# EasyEDA Pro project STM32最小系统.eprj

# Schematic Schematic1
Create Date: 2023-10-13; Page Name: 原理图; Project Name: STM32最小系统; Schematic Name: Schematic1; Update Date: 2023-10-28; Company: 王庆浩; Page Size: A4; Version: V1.0
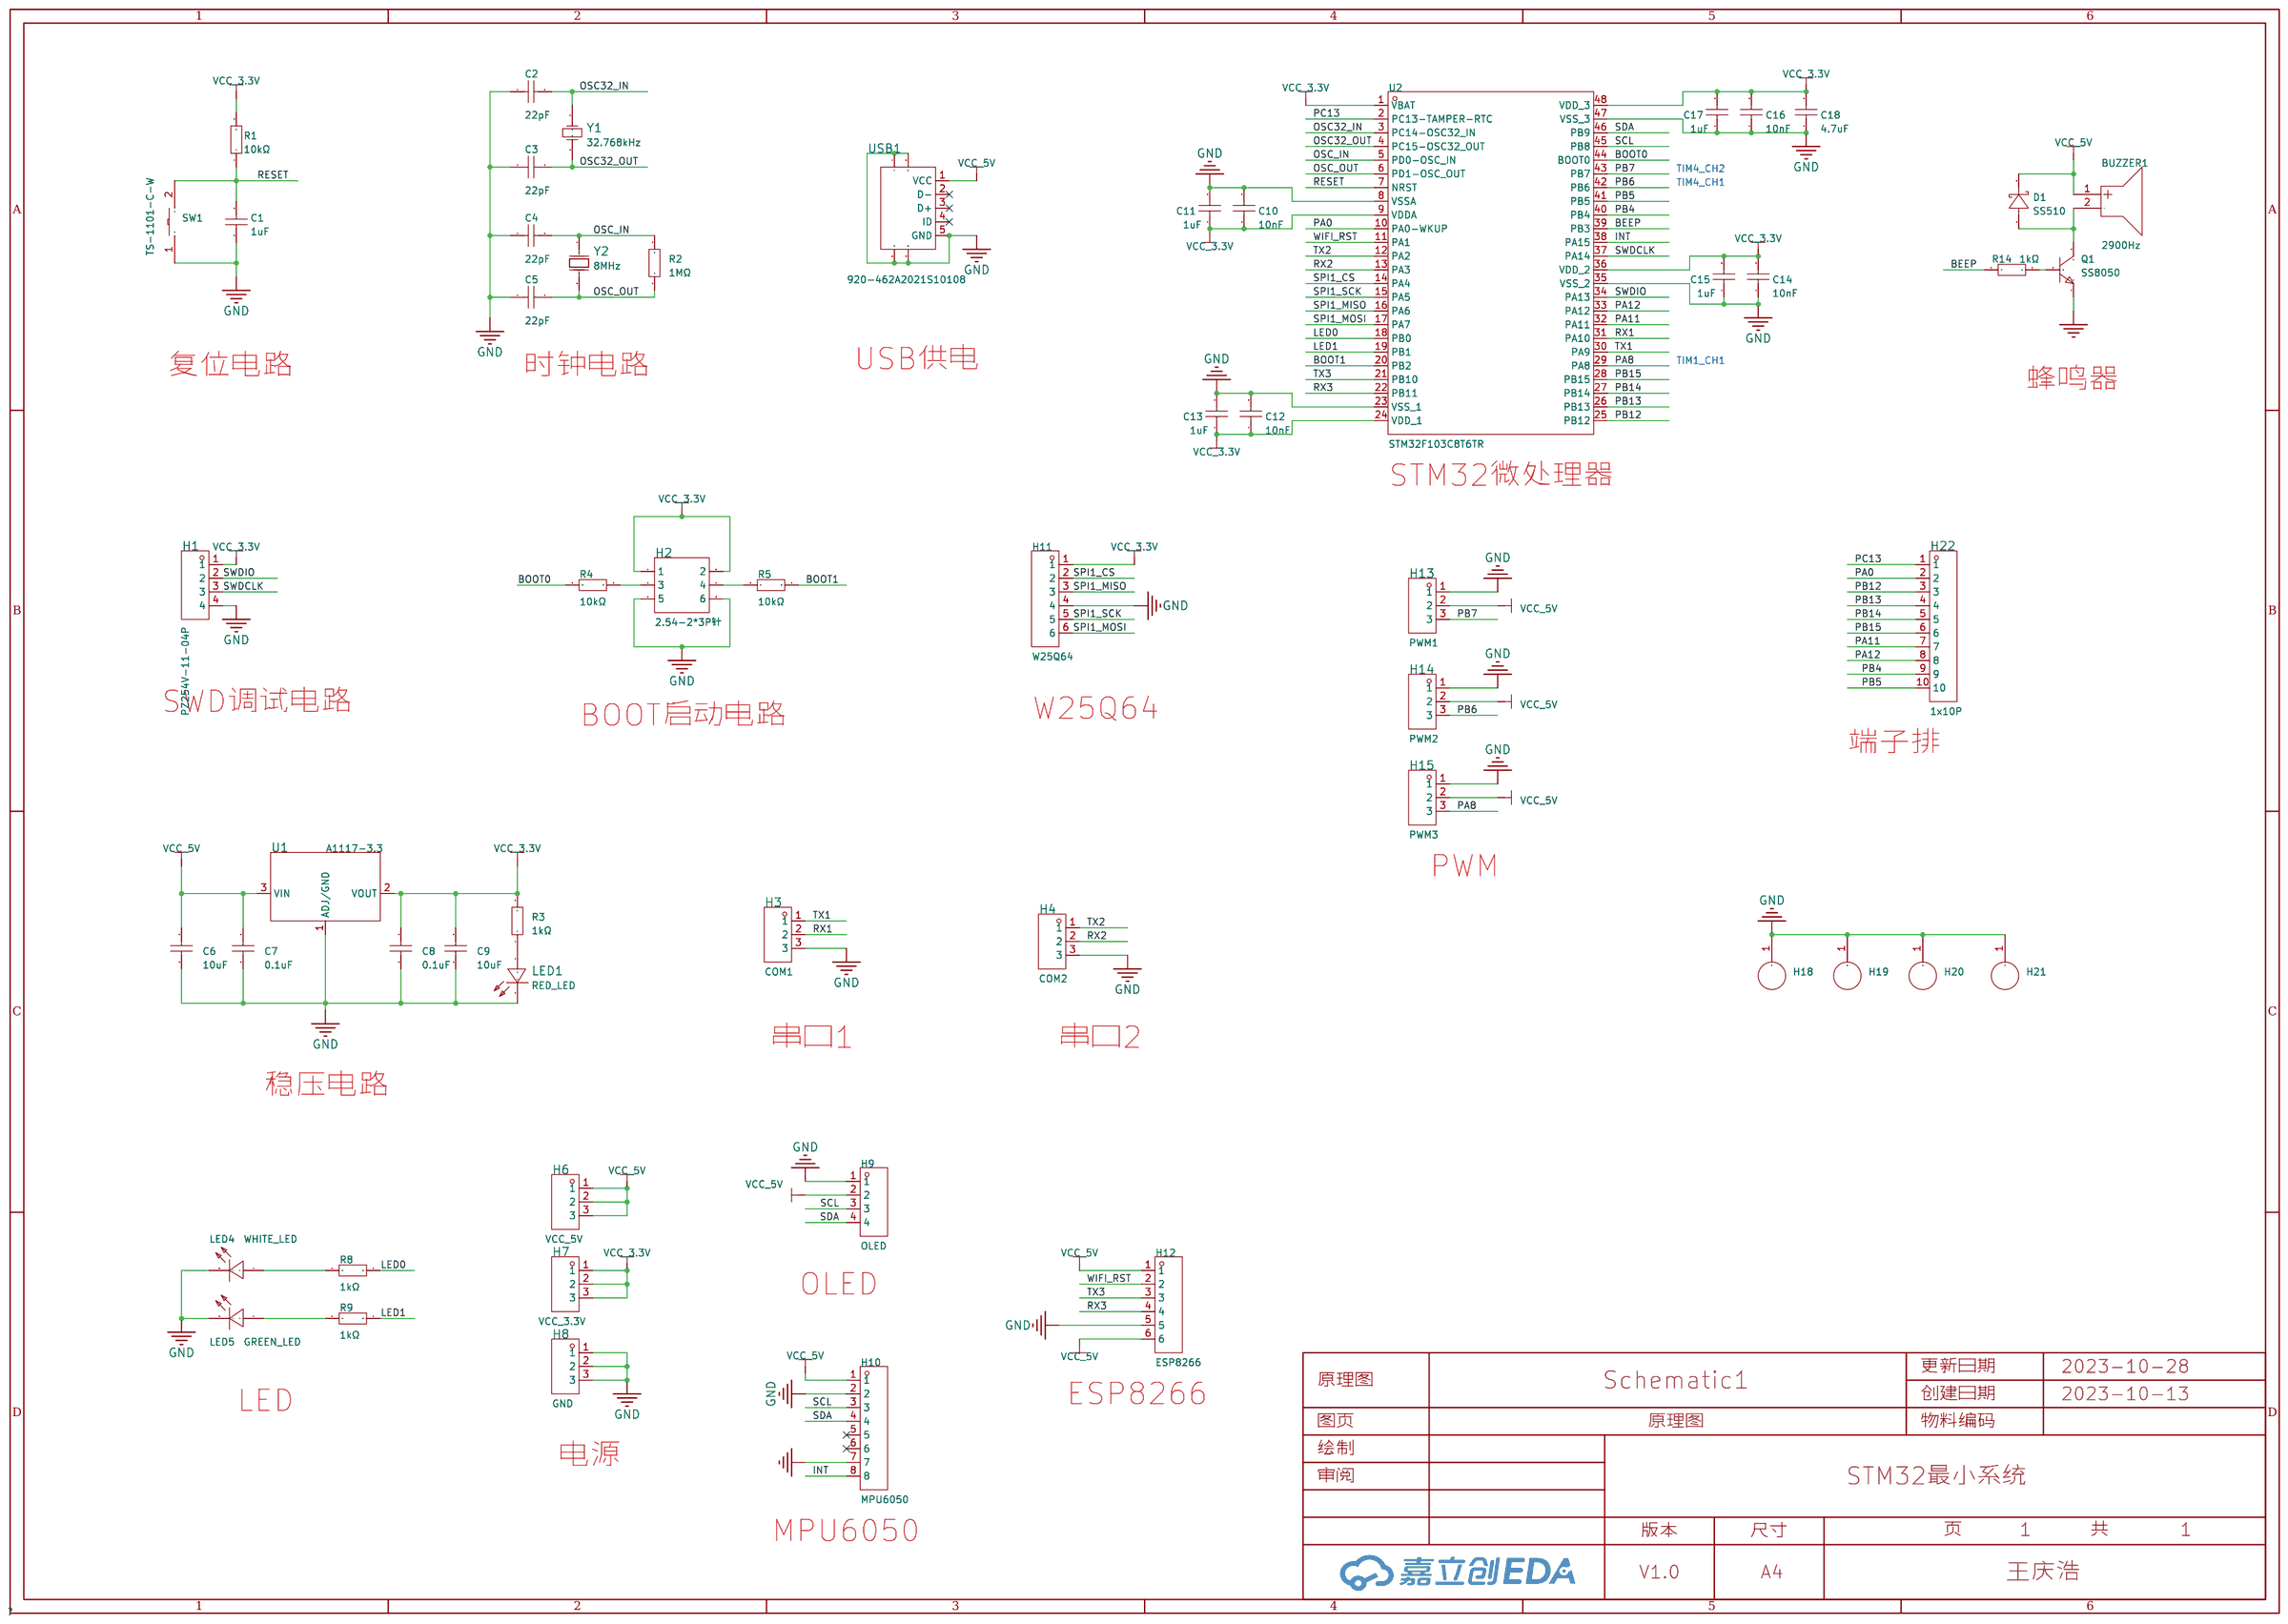
[diagram p0: schematic sheet]

## Parts
BUZZER1  2900Hz  [BUZ-TH_BD9.6-P5.00-D0.7-FD]
C1  1uF  [C0805]
C2  22pF  [C0805]
C3  22pF  [C0805]
C4  22pF  [C0805]
C5  22pF  [C0805]
C6  10uF  [C0805]
C7  0.1uF  [C0805]
C8  0.1uF  [C0805]
C9  10uF  [C0805]
C10  10nF  [C0805]
C11  1uF  [C0805]
C12  10nF  [C0805]
C13  1uF  [C0805]
C14  10nF  [C0805]
C15  1uF  [C0805]
C16  10nF  [C0805]
C17  1uF  [C0805]
C18  4.7uF  [C0805]
D1  SS510  [SMA_L4.3-W2.6-LS5.0-RD]
H1  PZ254V-11-04P  [HDR-TH_4P-P2.54-V-M]
H2  2.54-2*3P针  [HDR-TH_6P-P2.54-V-M-R2-C3-S2.54-1]
H3  COM1  [HDR-TH_3P-P2.54-V-M]
H4  COM2  [HDR-TH_3P-P2.54-V-M]
H6  VCC_5V  [HDR-TH_3P-P2.54-V-M]
H7  VCC_3.3V  [HDR-TH_3P-P2.54-V-M]
H8  GND  [HDR-TH_3P-P2.54-V-M]
H9  OLED  [HDR-TH_4P-P2.54-V-F]
H10  MPU6050  [HDR-TH_8P-P2.54-V-F]
H11  W25Q64  [HDR-TH_6P-P2.54-V-F]
H12  ESP8266  [HDR-TH_6P-P2.54-V-F]
H13  PWM1  [HDR-TH_3P-P2.54-V-M]
H14  PWM2  [HDR-TH_3P-P2.54-V-M]
H15  PWM3  [HDR-TH_3P-P2.54-V-M]
H18  -  [固定孔封装]
H19  -  [固定孔封装]
H20  -  [固定孔封装]
H21  -  [固定孔封装]
H22  1x10P  [HDR-TH_10P-P2.54-V-M]
LED1  RED_LED  [LED1206-R-RD_RED]
LED4  WHITE_LED  [LED0805-R-RD]
LED5  GREEN_LED  [LED0805-R-RD]
Q1  SS8050  [SOT-23-3_L2.9-W1.3-P1.90-LS2.4-BR]
R1  10kΩ  [R0805]
R2  1MΩ  [R0805]
R3  1kΩ  [R0805]
R4  10kΩ  [R0805]
R5  10kΩ  [R0805]
R8  1kΩ  [R0805]
R9  1kΩ  [R0805]
R14  1kΩ  [R0805]
SW1  TS-1101-C-W  [SW-SMD_L6.0-W3.3-LS8.0]
U1  A1117-3.3  [SOT-223-3_L6.5-W3.4-P2.30-LS7.0-BR-1]
U2  STM32F103C8T6TR  [LQFP-48_L7.0-W7.0-P0.50-LS9.0-BL]
USB1  920-462A2021S10108  [MINI-USB-SMD_C105424]
Y1  32.768kHz  [OSC-TH_BD3.1-P0.8-D0.3]
Y2  8MHz  [OSC-TH_L10.0-W4.5-P5.00]

## Library data of the parts
BUZZER1 = Cy-9650-5029: 驱动方式:有源(内含驱动线路);构造类型:电磁式;额定电压:5V;工作电压:4V~7V;频率:2900Hz;声压(SPL):85dB@5V,10cm;直径(φD):9.6mm;高度:5.5mm;; LCSC Part Name: 电磁式有源蜂鸣器; Supplier Part: C200213; Manufacturer: CY(超音); Supplier Footprint: 插件; JLCPCB Part Class: 扩展库; Datasheet: https://atta.szlcsc.com/upload/public/pdf/source/20180420/C200213_A5C4D66C08EDDCFBFC3C90ECB296389D.pdf; Supplier: LCSC; Oscillator Circuit: 有源(内含驱动线路); Technology Type: 电磁式; Rated Voltage: 5V; Operating Voltage: 4V~7V; Sound Pressure Level (SPL): 85dB@5V,10cm; Diameter (φD): 9.6mm; Height: 5.5mm
C1 C11 C13 C15 C17 = CL21B105KBFNNNE: 容值:1uF;精度:±10%;额定电压:50V;材质(温度系数):X7R;; LCSC Part Name: 1uF ±10% 50V; Supplier Part: C28323; Manufacturer: SAMSUNG(三星); Supplier Footprint: 0805; JLCPCB Part Class: 基础库; Datasheet: https://atta.szlcsc.com/upload/public/pdf/source/20160103/1457707718219.pdf; Supplier: LCSC; Tolerance: ±10%; Voltage Rated: 50V; Temperature Coefficient: X7R
C2-C5 = CL21C220JBANNNC: 容值:22pF;精度:±5%;额定电压:50V;材质(温度系数):C0G;; LCSC Part Name: 22pF ±5% 50V; Supplier Part: C1804; Manufacturer: SAMSUNG(三星); Supplier Footprint: 0805; JLCPCB Part Class: Basic Part; Datasheet: https://atta.szlcsc.com/upload/public/pdf/source/20160103/1457707697973.pdf; Supplier: LCSC; Tolerance: ±5%; Voltage Rated: 50V; Temperature Coefficient: C0G
C6-C9 = CC0805KRX7R9BB104: 容值:100nF;精度:±10%;额定电压:50V;材质(温度系数):X7R;; LCSC Part Name: 100nF ±10% 50V; Supplier Part: C49678; Manufacturer: YAGEO(国巨); Supplier Footprint: 0805; JLCPCB Part Class: Basic Part; Datasheet: https://atta.szlcsc.com/upload/public/pdf/source/20151026/1457707504898.pdf; Supplier: LCSC; Tolerance: ±10%; Voltage Rated: 50V; Temperature Coefficient: X7R
C10 C12 C14 C16 C18 = 0805B103K500NT_C52278: 容值:10nF;精度:±10%;额定电压:50V;材质(温度系数):X7R;; LCSC Part Name: 10nF ±10% 50V; Supplier Part: C52278; Manufacturer: FH(风华); Manufacturer Part: 0805B103K500NT; Supplier Footprint: 0805; JLCPCB Part Class: Extended Part; Datasheet: https://atta.szlcsc.com/upload/public/pdf/source/20170923/C52278_1506149485247988826.pdf; Supplier: LCSC; Tolerance: ±10%; Voltage Rated: 50V; Temperature Coefficient: X7R
D1 = SS510_C727067: 二极管配置:独立式;直流反向耐压(Vr):100V;平均整流电流(Io):5A;正向压降(Vf):850mV@5A;反向电流(Ir):500uA@100V;; LCSC Part Name: 100V 5A 850mV@5A; Supplier Part: C727067; Manufacturer: TWGMC(台湾迪嘉); Supplier Footprint: SMA; JLCPCB Part Class: Extended Part; Datasheet: https://atta.szlcsc.com/upload/public/pdf/source/20200828/C727064_BD0A2B36CBC76CEA4B6710C57718D41F.pdf; Supplier: LCSC; Diode Configuration: 独立式; Reverse Voltage (Vr): 100V; Average Rectified Current (Io): 5A; Forward Voltage (Vf@If): 850mV@5A; Reverse Leakage Current (Ir): 500uA@100V
H1 = PZ254V-11-04P: 排数:单排;总PIN位数:4P;间距:2.54mm;插针结构:1x4P;行距:-;安装类型:直插;圆针/方针:方针;额定电流:3A;额定电压:250V;配合针长度:6mm;塑高:2.5mm;端接针长度:3mm;触头材质:-;工作温度范围:-40℃~+105℃;颜色:黑色;; LCSC Part Name: 2.54mm 1x4P 直插 方针; Supplier Part: C2691448; Manufacturer: XFCN(兴飞); Supplier Footprint: 插件,P=2.54mm; JLCPCB Part Class: Extended Part; Datasheet: https://atta.szlcsc.com/upload/public/pdf/source/20200309/C492403_F9F19131791D08044AD4F84F8E751A34.pdf; Supplier: LCSC; Number of Rows: 单排; Number of Pins: 4P; Pitch: 2.54mm; Pin Structure: 1x4P; Mounting Type: 直插; Circluar Pins/Square Pins: 方针; Current Rating (Max): 3A; Voltage Rating (Max): 250V; Length of Mating Pin: 6mm; Insulation Height: 2.5mm; Length of End Connection Pin: 3mm; Operating Temperature Range: -40℃~+105℃; Color: 黑色
H2 = 2.54-2*3P针: 排数:双排;总PIN位数:6P;间距:2.54mm;插针结构:-;行距:-;安装类型:直插;圆针/方针:-;额定电流:-;额定电压:-;配合针长度:-;塑高:-;触头材质:-;触头镀层:-;颜色:黑色;; LCSC Part Name: 2.54mm 直插; Supplier Part: C65114; Manufacturer: BOOMELE(博穆精密); Supplier Footprint: 插件,P=2.54mm; JLCPCB Part Class: Extended Part; Supplier: LCSC; Number of Rows: 双排; Number of Pins: 6P; Pitch: 2.54mm; Mounting Type: 直插; Color: 黑色
H3 H4 H6-H8 H13-H15 = PZ254V-11-03P: 排数:单排;总PIN位数:3;间距:2.54mm;插针结构:1x3P;行距:-;安装类型:直插;圆针/方针:方针;额定电流:3A;额定电压:250V;配合针长度:6mm;塑高:2.5mm;端接针长度:3mm;工作温度范围:-40℃~+105℃;颜色:黑色;; LCSC Part Name: 2.54mm 1x3P 直插 方针; Supplier Part: C2937625; Manufacturer: XFCN(兴飞); Supplier Footprint: 直插,P=2.54mm; JLCPCB Part Class: Extended Part; Datasheet: 2022-07-12/581362A/62b9d00620994b3696be7eb4af85ad72/双排排针和单排排针.pdf; Supplier: LCSC; Number of Rows: 单排; Number of Pins: 3; Pitch: 2.54mm; Pin Structure: 1x3P; Mounting Type: 直插; Circluar Pins/Square Pins: 方针; Current Rating (Max): 3A; Voltage Rating (Max): 250V; Length of Mating Pin: 6mm; Insulation Height: 2.5mm; Length of End Connection Pin: 3mm; Operating Temperature Range: -40℃~+105℃; Color: 黑色
H9 = PM254V-11-04-H85: 排数:单排;总孔位数:4P;间距:2.54mm;插孔结构:1x4P;行距:-;安装类型:直插;塑高:-;触头材质:黄铜;触头镀层:-;; LCSC Part Name: 间距:2.54mm 1x4P 直插; Supplier Part: C541851; Manufacturer: XFCN(兴飞); Supplier Footprint: 插件,P=2.54mm; JLCPCB Part Class: Extended Part; Datasheet: https://atta.szlcsc.com/upload/public/pdf/source/20200518/C541849_85853D71FC67C51915A806977A588FDA.pdf; Supplier: LCSC; Number of Rows: 单排; Number of Holes: 4P; Pitch: 2.54mm; Holes Structure: 1x4P; Mounting Type: 直插; Contact Material: 黄铜
H10 = PM254-1-08-Z-8.5: 排数:单排;总孔位数:8P;间距:2.54mm;插孔结构:1x8P;行距:-;安装类型:直插;圆孔/方孔:方孔;额定电流:3A;额定电压:-;插孔方向:顶部;塑高:8.5mm;工作温度范围:-40℃~+105℃;; LCSC Part Name: 间距:2.54mm 1x8P 直插; Supplier Part: C2897371; Manufacturer: HCTL(华灿天禄); Supplier Footprint: 插件,P=2.54mm; JLCPCB Part Class: Extended Part; Datasheet: https://atta.szlcsc.com/upload/public/pdf/source/20230609/534BE42964C679BDE98E061007C4ABD6.pdf; Supplier: LCSC; Number of Rows: 单排; Number of Holes: 8P; Pitch: 2.54mm; Holes Structure: 1x8P; Mounting Type: 直插; Circular Hole / Square Hole: 方孔; Current Rating (Max): 3A; Holes Direction: 顶部; Insulation Height: 8.5mm; Operating Temperature Range: -40℃~+105℃
H11 H12 = PM254V-11-06-H85: 排数:单排;总孔位数:6P;间距:2.54mm;插孔结构:1x6P;行距:-;安装类型:直插;圆孔/方孔:方孔;额定电流:3A;额定电压:250V;插孔方向:顶部;塑高:-;工作温度范围:-40℃~+105℃;; LCSC Part Name: 间距:2.54mm 1x6P 直插; Supplier Part: C2832269; Manufacturer: XFCN(兴飞); Supplier Footprint: 插件,P=2.54mm; JLCPCB Part Class: Extended Part; Datasheet: https://atta.szlcsc.com/upload/public/pdf/source/20210514/C2832269_B3EC97736B37C2783BDCE3050AA57447.pdf; Supplier: LCSC; Number of Rows: 单排; Number of Holes: 6P; Pitch: 2.54mm; Holes Structure: 1x6P; Mounting Type: 直插; Circular Hole / Square Hole: 方孔; Current Rating (Max): 3A; Voltage Rating (Max): 250V; Holes Direction: 顶部; Operating Temperature Range: -40℃~+105℃
H18-H21 = 固定孔: 铜柱孔
H22 = PZ254V-11-10P: 排数:单排;总PIN位数:10P;间距:2.54mm;插针结构:1x10P;行距:-;安装类型:直插;圆针/方针:方针;额定电流:-;额定电压:-;配合针长度:6mm;塑高:2.5mm;端接针长度:3mm;触头材质:黄铜;触头镀层:-;工作温度范围:-40℃~+105℃;颜色:黑色;; LCSC Part Name: 2.54mm 1x10P 直插 方针; Supplier Part: C492409; Manufacturer: XFCN(兴飞); Supplier Footprint: 插件,P=2.54mm; JLCPCB Part Class: 扩展库; Datasheet: https://atta.szlcsc.com/upload/public/pdf/source/20200309/C492409_129C9431BDD62EBBBD0A643B6AAB9FBD.pdf; Supplier: LCSC; Number of Rows: 单排; Number of Pins: 10P; Pitch: 2.54mm; Mounting Type: 直插; Circluar Pins/Square Pins: 方针; Length of Mating Pin: 6mm; Insulation Height: 2.5mm; Length of End Connection Pin: 3mm; Contact Material: 黄铜; Operating Temperature Range: -40℃~+105℃; Color: 黑色
LED1 = NCD1206R1: 发光颜色:红灯;; LCSC Part Name: 红灯 1206红灯   正贴; Supplier Part: C84270; Manufacturer: 国星光电; Supplier Footprint: 1206; JLCPCB Part Class: 扩展库; Datasheet: https://atta.szlcsc.com/upload/public/pdf/source/20200820/C84270_26D056BA53480CD9796A84C2EB45318C.pdf; Supplier: LCSC; Emitted Color: 红灯
LED4 LED5 = NCD0805R1: 发光颜色:红灯;; LCSC Part Name: 红灯; Supplier Part: C84256; Manufacturer: 国星光电; Supplier Footprint: 0805; JLCPCB Part Class: Basic Part; Datasheet: https://atta.szlcsc.com/upload/public/pdf/source/20200820/C84256_F0A75A43B3EAD75808600A0514C76B99.pdf; Supplier: LCSC; Emitted Color: 红灯
Q1 = SS8050_C2150: 晶体管类型:NPN;集射极击穿电压(Vceo):25V;集电极电流(Ic):1.5A;功率(Pd):300mW;直流电流增益(hFE@Ic,Vce):200@100mA,1V;; LCSC Part Name: NPN 25V 1.5A Y1 200-350; Supplier Part: C2150; Manufacturer: CJ(江苏长电/长晶); Supplier Footprint: SOT-23; JLCPCB Part Class: 基础库; Datasheet: https://atta.szlcsc.com/upload/public/pdf/source/20230322/AEE86F4B043774EFF80CAEA14A37D9E9.pdf; Supplier: LCSC; Transistor Type: NPN; Collector-Emitter Breakdown Voltage (Vceo): 25V; Collector Current (Ic): 1.5A; Power Dissipation (Pd): 300mW; Collector Cut-Off Current (Icbo): 100nA; Collector-Emitter Saturation Voltage (VCE(sat)@Ic,Ib): 500mV@800mA,80mA; DC Current Gain (hFE@Ic,Vce): 200@100mA,1V; Transition Frequency (fT): 100MHz; Operating Temperature: +150℃@(Tj)
R1 R4 R5 = 0805W8F1002T5E_C17414: 电阻类型:厚膜电阻;阻值:10kΩ;精度:±1%;功率:125mW;; LCSC Part Name: 10kΩ ±1% 125mW; Supplier Part: C17414; Manufacturer: UNI-ROYAL(厚声); Manufacturer Part: 0805W8F1002T5E; Supplier Footprint: 0805; JLCPCB Part Class: 基础库; Datasheet: https://atta.szlcsc.com/upload/public/pdf/source/20200306/C422600_1E6D84923E4A46A82E41ADD87F860B5C.pdf; Supplier: LCSC; Type: 厚膜电阻; Tolerance: ±1%; Power(Watts): 125mW; Temperature Coefficient: ±100ppm/℃; Overload Voltage (Max): 150V; Operating Temperature Range: -55℃~+155℃
R2 = 0805W8F1004T5E: 电阻类型:厚膜电阻;阻值:1MΩ;精度:±1%;功率:125mW;; LCSC Part Name: 1MΩ ±1% 125mW; Supplier Part: C17514; Manufacturer: UNI-ROYAL(厚声); Supplier Footprint: 0805; JLCPCB Part Class: Basic Part; Datasheet: https://atta.szlcsc.com/upload/public/pdf/source/20200306/C422600_1E6D84923E4A46A82E41ADD87F860B5C.pdf; Supplier: LCSC; Type: 厚膜电阻; Tolerance: ±1%; Power(Watts): 125mW; Temperature Coefficient: ±100ppm/℃; Overload Voltage (Max): 150V; Operating Temperature Range: -55℃~+155℃
R3 R8 R9 R14 = 0805W8F1001T5E: 电阻类型:厚膜电阻;阻值:1kΩ;精度:±1%;功率:125mW;; LCSC Part Name: 1kΩ ±1% 125mW; Supplier Part: C17513; Manufacturer: UNI-ROYAL(厚声); Supplier Footprint: 0805; JLCPCB Part Class: Basic Part; Datasheet: https://atta.szlcsc.com/upload/public/pdf/source/20200306/C422600_1E6D84923E4A46A82E41ADD87F860B5C.pdf; Supplier: LCSC; Type: 厚膜电阻; Tolerance: ±1%; Power(Watts): 125mW; Temperature Coefficient: ±100ppm/℃; Overload Voltage (Max): 150V; Operating Temperature Range: -55℃~+155℃
SW1 = TS-1101-C-W: 触点电流:50mA;额定电压(AC):-;额定电压(DC):12V;额定功率:-;绝缘电阻:-;电路结构:单刀单掷;安装方式:立贴;带灯:无;作用力:260gf;机械寿命:5万次;带支架:否;; LCSC Part Name: 立贴 6*3.6*2.5mm 轻触开关 一型3*6*2.5有白ZD b拉伸白色带淡绿按键 卷装; Supplier Part: C318938; Manufacturer: XKB Connectivity(中国星坤); Supplier Footprint: SMD; JLCPCB Part Class: 扩展库; Datasheet: https://atta.szlcsc.com/upload/public/pdf/source/20200227/C318938_C2E53B1EEDE37D980A33616AC086DE53.pdf; Supplier: LCSC; Contact Current: 50mA; Voltage Rating (DC): 12V; Circuit: 单刀单掷; Mounting Style: 立贴; Actuator Style: 矩形按钮; Actuator/Cap Color: 白色带淡绿; With Lamp: 无; Operating Force: 260gf; Mechanical Life: 5万次; Operating Temperature: -30℃~+85℃; Switch Length: 6mm; Switch Width: 3.6mm; Switch Height: 2.5mm; Strike Gundam: 否
U1 = A1117-3.3: LCSC Part Name: AMS1117-3.3; Supplier Part: C7432020; Manufacturer: IDCHIP(英锐芯); Supplier Footprint: SOT-223; Datasheet: https://atta.szlcsc.com/upload/public/pdf/source/20230625/435FEEFA02C0FE449E7397A11F8448E0.pdf; Supplier: LCSC
U2 = STM32F103C8T6TR: Supplier Part: C2969777; Manufacturer: ST(意法半导体); Supplier Footprint: LQFP-48; JLCPCB Part Class: 扩展库; Datasheet: https://atta.szlcsc.com/upload/public/pdf/source/20220628/95EE8CB51361BFD20205E6D0986143A8.pdf; Supplier: LCSC
USB1 = 920-462A2021S10108: 连接器类型:Mini-B;标准:USB 2.0;公母:母座;触点数量:5P;端口数量:1;; LCSC Part Name: Mini-B 母座; Supplier Part: C105424; Manufacturer: 精拓金; Supplier Footprint: SMD; JLCPCB Part Class: Extended Part; Datasheet: https://atta.szlcsc.com/upload/public/pdf/source/20210305/C105424_2FE4567BA4C4825921316FFF365C367B.pdf; Supplier: LCSC; Connector Type: Mini-B; Standard: USB 2.0; Gender: 母座; Number of Contacts: 5P; Number of Ports: 1
Y1 = X308032768KGB2SC: 频率:32.768kHz;频率公差:±10ppm;负载电容:12.5pF;; LCSC Part Name: 32.768kHz ±10ppm 12.5pF YT-38; Supplier Part: C52082; Manufacturer: YXC(扬兴晶振); Supplier Footprint: DT-38; JLCPCB Part Class: 扩展库; Datasheet: https://atta.szlcsc.com/upload/public/pdf/source/20210729/394323D37097DADF5DA3ECA9C1DCF4BF.pdf; Supplier: LCSC; Crystal Type: 圆柱体晶振; Frequency Tolerance: ±10ppm; Load Capacitance: 12.5pF; Operating Temperature: -20℃~+70℃
Y2 = X49SD8MSD2SC: 频率:8MHz;频率公差:±20ppm;负载电容:20pF;; LCSC Part Name: 8MHz ±20ppm 20pF HC-49US; Supplier Part: C21263; Manufacturer: YXC(扬兴晶振); Supplier Footprint: HC-49S; JLCPCB Part Class: Extended Part; Datasheet: https://atta.szlcsc.com/upload/public/pdf/source/20210903/A997D130AE99CBB55D9024F9BE6DA174.pdf; Supplier: LCSC; Crystal Type: 49S晶振; Frequency Tolerance: ±20ppm; Frequency Stability: ±30ppm; Load Capacitance: 20pF; Operating Temperature: -20℃~+70℃

## Nets
GND: C1.1 C2.1 C3.1 C4.1 C5.1 C6.1 C7.1 C8.1 C9.1 C10.2 C11.2 C12.2 C13.2 C14.1 C15.1 C16.1 C17.1 C18.1 H1.4 H2.5 H2.6 H3.3 H4.3 H8.1 H8.2 H8.3 H9.1 H10.2 H10.7 H11.4 H12.5 H13.1 H14.1 H15.1 H18.1 H19.1 H20.1 H21.1 LED1.2(K) LED4.2(-) LED5.2(-) Q1.2(E) SW1.1 U1.1(ADJ/GND) U2.8(VSSA) U2.23(VSS_1) U2.35(VSS_2) U2.47(VSS_3) USB1.5(GND) USB1.6 USB1.7 USB1.8 USB1.9
VCC_3.3V: C8.2 C9.2 C10.1 C11.1 C12.1 C13.1 C14.2 C15.2 C16.2 C17.2 C18.2 H1.1 H2.1 H2.2 H7.1 H7.2 H7.3 H11.1 R1.2 R3.2 U1.2(VOUT) U2.1(VBAT) U2.9(VDDA) U2.24(VDD_1) U2.36(VDD_2) U2.48(VDD_3)
VCC_5V: BUZZER1.1(+) C6.2 C7.2 D1.1(K) H6.1 H6.2 H6.3 H9.2 H10.1 H12.1 H12.6 H13.2 H14.2 H15.2 U1.3(VIN) USB1.1(VCC)
BEEP: R14.2 U2.39(PB3)
BOOT0: R4.1 U2.44(BOOT0)
BOOT1: R5.2 U2.20(PB2)
INT: H10.8 U2.38(PA15)
LED0: R8.1 U2.18(PB0)
LED1: R9.1 U2.19(PB1)
OSC32_IN: C2.2 U2.3(PC14-OSC32_IN) Y1.2(OSC2)
OSC32_OUT: C3.2 U2.4(PC15-OSC32_OUT) Y1.1(OSC1)
OSC_IN: C4.2 R2.2 U2.5(PD0-OSC_IN) Y2.1(OSC1)
OSC_OUT: C5.2 R2.1 U2.6(PD1-OSC_OUT) Y2.2(OSC2)
PA0: H22.2 U2.10(PA0-WKUP)
PA8: H15.3 U2.29(PA8)
PA11: H22.7 U2.32(PA11)
PA12: H22.8 U2.33(PA12)
PB4: H22.9 U2.40(PB4)
PB5: H22.10 U2.41(PB5)
PB6: H14.3 U2.42(PB6)
PB7: H13.3 U2.43(PB7)
PB12: H22.3 U2.25(PB12)
PB13: H22.4 U2.26(PB13)
PB14: H22.5 U2.27(PB14)
PB15: H22.6 U2.28(PB15)
PC13: H22.1 U2.2(PC13-TAMPER-RTC)
RESET: C1.2 R1.1 SW1.2 U2.7(NRST)
RX1: H3.2 U2.31(PA10)
RX2: H4.2 U2.13(PA3)
RX3: H12.4 U2.22(PB11)
SCL: H9.3 H10.3 U2.45(PB8)
SDA: H9.4 H10.4 U2.46(PB9)
SPI1_CS: H11.2 U2.14(PA4)
SPI1_MISO: H11.3 U2.16(PA6)
SPI1_MOSI: H11.6 U2.17(PA7)
SPI1_SCK: H11.5 U2.15(PA5)
SWDCLK: H1.3 U2.37(PA14)
SWDIO: H1.2 U2.34(PA13)
TX1: H3.1 U2.30(PA9)
TX2: H4.1 U2.12(PA2)
TX3: H12.3 U2.21(PB10)
WIFI_RST: H12.2 U2.11(PA1)
$1N2099: H2.3 R4.2
$1N2100: H2.4 R5.1
$1N5135: LED1.1(A) R3.1
$1N5723: LED4.1(+) R8.2
$1N5726: LED5.1(+) R9.2
$1N9189: Q1.1(B) R14.1
$1N9400: BUZZER1.2(-) D1.2(A) Q1.3(C)

Not connected (* = marked no-connect by the designer): H10 5* 6*; USB1 2(D-)* 3(D+)* 4(ID)*

## Notes on the sheet
- TIM4_CH2
- TIM4_CH1
- USB供电
- TIM1_CH1
- 复位电路
- 时钟电路
- 蜂鸣器
- STM32微处理器
- SWD调试电路
- BOOT启动电路
- W25Q64
- 端子排
- PWM
- 串口1
- 串口2
- 稳压电路
- OLED
- ESP8266
- LED
- 电源
- MPU6050

# Board PCB1
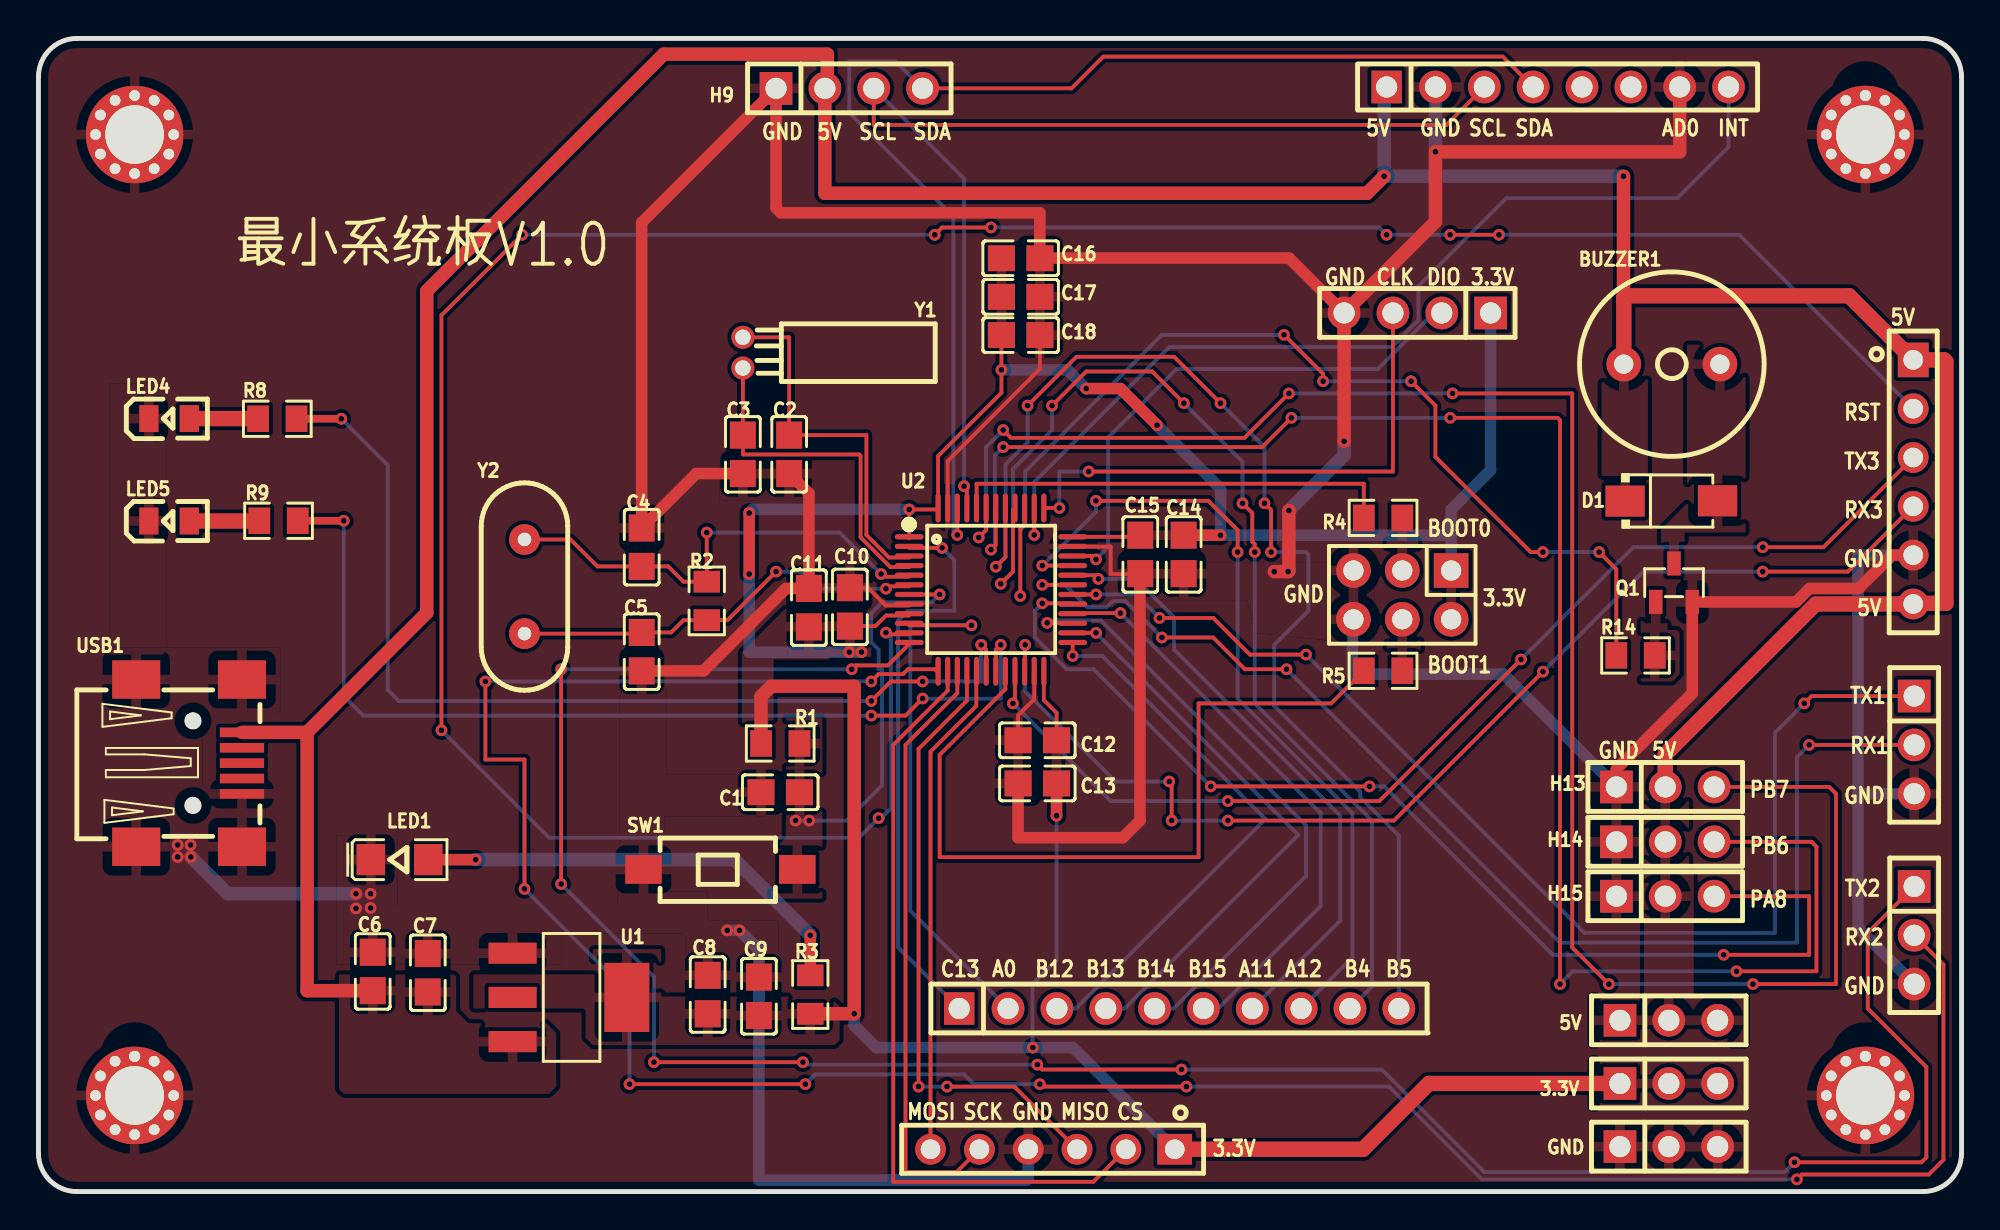
[diagram p1: board, top side]
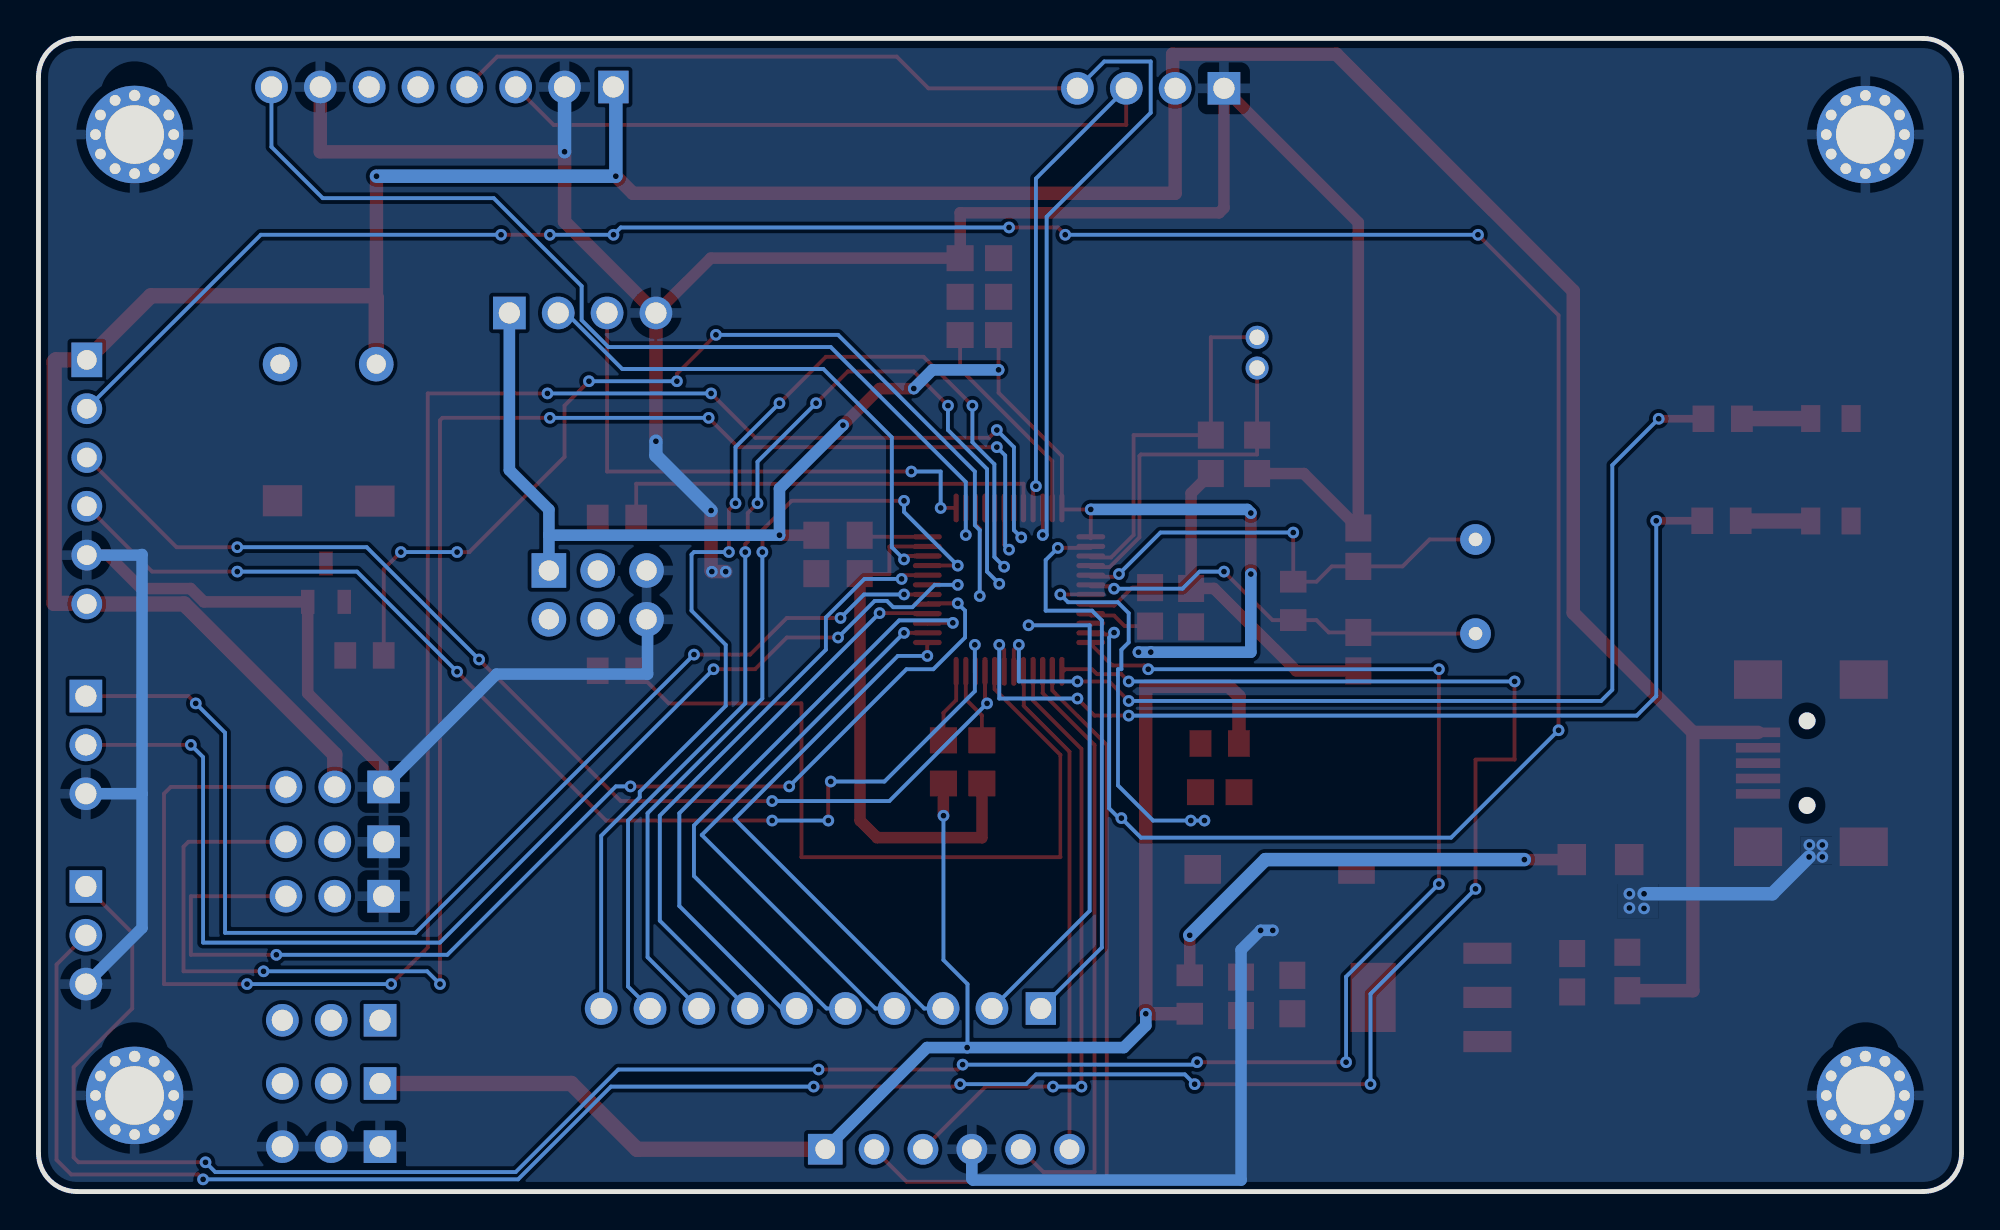
[diagram p2: board, bottom side, seen from below]

Outline 100 x 60 mm; copper layers: Top Layer, Bottom Layer. Coordinates in mm from the lower left corner of the outline.
Outline path: 0,58 0,2 arc(0.59,0.59) 2,0 98,0 arc(99.41,0.59) 100,2 100,58 arc(99.41,59.41) 98,60 2,60 arc(0.59,59.41) 0,58
Stack: Top Layer 0.035mm / Dielectric1 1.51mm FR4 er 4.5 / Bottom Layer 0.035mm

## Design rules (mm)
net VCC_3.3V: POWER
net GND: POWER
net VCC_5V: POWER
template: 自定义配置
spacing copperThickness1oz (default): track to track 0.102, other pairs 0.152 to 0.3
spacing copperThickness2oz: track to track 0.203, other pairs 0.152 to 0.3
track width copperThickness1oz (default): min 0.127, default 0.254, max 2.54
track width copperThickness2oz: min 0.203, default 0.254, max 2.54
differential pair differentialPair (default): width min 0.127, default 0.254, max 2.54; gap min 0.152, default 0.152
via viaSize (default): diameter min 0.5, default 0.61, max 10; hole min 0.3, default 0.305, max 6.3

## Placement (name value [footprint] x y rotation side)
3.3V  VCC_3.3V  [HDR-TH_3P-P2.54-V-M]  84.78 5.62 0 top
5V  VCC_5V  [HDR-TH_3P-P2.54-V-M]  84.78 8.91 0 top
BUZZER1  2900Hz  [BUZ-TH_BD9.6-P5.00-D0.7-FD]  84.94 43.05 0 top
C1  1uF  [C0805]  38.57 20.78 0 top
C2  22pF  [C0805]  39.04 38.36 90 top
C3  22pF  [C0805]  36.63 38.36 90 top
C4  22pF  [C0805]  31.37 33.53 270 top
C5  22pF  [C0805]  31.37 28.09 90 top
C6  10uF  [C0805]  17.38 11.45 270 top
C7  0.1uF  [C0805]  20.25 11.38 270 top
C8  0.1uF  [C0805]  34.8 10.25 270 top
C9  10uF  [C0805]  37.47 10.16 270 top
C10  10nF  [C0805]  42.2 30.42 90 top
C11  1uF  [C0805]  40.06 30.38 90 top
C12  10nF  [C0805]  51.94 23.48 180 top
C13  1uF  [C0805]  51.94 21.24 180 top
C14  10nF  [C0805]  59.55 33.15 90 top
C15  1uF  [C0805]  57.29 33.15 90 top
C16  10nF  [C0805]  51.07 48.56 180 top
C17  1uF  [C0805]  51.07 46.56 180 top
C18  4.7uF  [C0805]  51.07 44.57 180 top
D1  SS510  [SMA_L4.3-W2.6-LS5.0-RD]  84.91 35.93 0 top
GND  GND  [HDR-TH_3P-P2.54-V-M]  84.78 2.34 0 top
H1  PZ254V-11-04P  [hdr-th_4p-p2.54-v-m]  71.7 45.72 0 top
H2  2.54-2*3P针  [HDR-TH_6P-P2.54-V-M-R2-C3-S2.54-1]  70.92 31.05 180 top
H3  COM1  [HDR-TH_3P-P2.54-V-M]  97.54 23.24 270 top
H4  COM2  [HDR-TH_3P-P2.54-V-M]  97.54 13.33 270 top
H9  OLED  [HDR-TH_4P-P2.54-V-F]  42.16 57.4 0 top
H10  MPU6050  [HDR-TH_8P-P2.54-V-F]  78.99 57.47 0 top
H11  W25Q64  [hdr-th_6p-p2.54-v-f]  52.74 2.2 0 top
H12  ESP8266  [hdr-th_6p-p2.54-v-f]  97.49 36.92 90 top
H13  PWM1  [HDR-TH_3P-P2.54-V-M]  84.59 21.05 0 top
H14  PWM2  [HDR-TH_3P-P2.54-V-M]  84.59 18.2 0 top
H15  PWM3  [HDR-TH_3P-P2.54-V-M]  84.59 15.37 0 top
H18  -  [固定孔封装]  5 5 0 top
H19  -  [固定孔封装#2]  5 55 0 top
H20  -  [固定孔封装]  95 55 0 top
H21  -  [固定孔封装]  95 5 0 top
H22  1x10P  [HDR-TH_10P-P2.54-V-M]  59.31 9.53 0 top
LED1  RED_LED  [LED1206-R-RD_RED]  18.78 17.27 0 top
LED4  WHITE_LED  [LED0805-R-RD]  6.79 40.22 0 top
LED5  GREEN_LED  [LED0805-R-RD]  6.79 34.89 0 top
Q1  SS8050  [SOT-23-3_L2.9-W1.3-P1.90-LS2.4-BR]  85.05 31.68 270 top
R1  10kΩ  [R0805]  38.57 23.31 180 top
R2  1MΩ  [R0805]  34.75 30.73 90 top
R3  1kΩ  [R0805]  40.13 10.25 270 top
R4  10kΩ  [R0805]  69.92 35.05 0 top
R5  10kΩ  [R0805]  69.92 27.1 180 top
R8  1kΩ  [R0805]  12.42 40.21 180 top
R9  1kΩ  [R0805]  12.48 34.9 180 top
R14  1kΩ  [R0805]  83.05 27.9 180 top
SW1  TS-1101-C-W  [SW-SMD_L6.0-W3.3-LS8.0]  35.46 16.76 0 top
U1  A1117-3.3  [SOT-223-3_L6.5-W3.4-P2.30-LS7.0-BR-1]  27.62 10.1 180 top
U2  STM32F103C8T6TR  [LQFP-48_L7.0-W7.0-P0.50-LS9.0-BL]  49.53 31.32 270 top
USB1  920-462A2021S10108  [MINI-USB-SMD_C105424]  7.83 22.29 270 top
Y1  32.768kHz  [OSC-TH_BD3.1-P0.8-D0.3]  36.63 43.65 180 top
Y2  8MHz  [OSC-TH_L10.0-W4.5-P5.00]  25.27 31.48 0 top

## Footprints (pads in the part's own frame, mm; a bottom-side part is the same pattern mirrored in y, then rotated)
BUZ-TH_BD9.6-P5.00-D0.7-FD
  round 1.8 hole 1: 1(-2.5,0) 2(2.5,0)
C0805
  rect 1.41x1.35 smd: 1(-1,0) 2(1,0)
HDR-TH_3P-P2.54-V-M
  rect 1.7x1.7 hole 1.1: 1(-2.54,0)
  round 1.7 hole 1.1: 2(0,0) 3(2.54,0)
HDR-TH_4P-P2.54-V-F
  rect 1.7x1.7 hole 1.1: 1(-3.81,0)
  round 1.7 hole 1.1: 2(-1.27,0) 3(1.27,0) 4(3.81,0)
hdr-th_4p-p2.54-v-m
  rect 1.7x1.7 hole 1.1: 1(3.81,0)
  round 1.7 hole 1.1: 2(1.27,0) 3(-1.27,0) 4(-3.81,0)
hdr-th_6p-p2.54-v-f
  rect 1.8x1.6 hole 1.02: 1(6.35,0)
  round 1.6 hole 1.02: 2(3.81,0) 3(1.27,0) 4(-1.27,0) 5(-3.81,0) 6(-6.35,0)
HDR-TH_6P-P2.54-V-M-R2-C3-S2.54-1
  rect 1.8x1.8 hole 1.05: 1(-2.54,-1.27)
  round 1.8 hole 1.05: 2(-2.54,1.27) 3(0,-1.27) 4(0,1.27) 5(2.54,-1.27) 6(2.54,1.27)
HDR-TH_8P-P2.54-V-F
  rect 1.575x1.7 hole 1.1: 1(-8.89,0)
  round 1.7 hole 1.1: 2(-6.35,0) 3(-3.81,0) 4(-1.27,0) 5(1.27,0) 6(3.81,0) 7(6.35,0) 8(8.89,0)
HDR-TH_10P-P2.54-V-M
  rect 1.575x1.7 hole 1.1: 1(-11.43,0)
  round 1.7 hole 1.1: 2(-8.89,0) 3(-6.35,0) 4(-3.81,0) 5(-1.27,0) 6(1.27,0) 7(3.81,0) 8(6.35,0) 9(8.89,0) 10(11.43,0)
LED0805-R-RD
  rect 1x1.399 smd: 1(1.05,0) 2(-1.05,0)
LED1206-R-RD_RED
  rect 1.485x1.62 smd: 1(1.492,0) 2(-1.492,0)
LQFP-48_L7.0-W7.0-P0.50-LS9.0-BL
  oval 0.27x1.5 smd: 1(-2.75,-4.25) 2(-2.25,-4.25) 3(-1.75,-4.25) 4(-1.25,-4.25) 5(-0.75,-4.25) 6(-0.25,-4.25) 7(0.25,-4.25) 8(0.75,-4.25) 9(1.25,-4.25) 10(1.75,-4.25) 11(2.25,-4.25) 12(2.75,-4.25) 25(2.75,4.25) 26(2.25,4.25) 27(1.75,4.25) 28(1.25,4.25) 29(0.75,4.25) 30(0.25,4.25) 31(-0.25,4.25) 32(-0.75,4.25) 33(-1.25,4.25) 34(-1.75,4.25) 35(-2.25,4.25) 36(-2.75,4.25)
  oval 1.5x0.27 smd: 13(4.25,-2.75) 14(4.25,-2.25) 15(4.25,-1.75) 16(4.25,-1.25) 17(4.25,-0.75) 18(4.25,-0.25) 19(4.25,0.25) 20(4.25,0.75) 21(4.25,1.25) 22(4.25,1.75) 23(4.25,2.25) 24(4.25,2.75) 37(-4.25,2.75) 38(-4.25,2.25) 39(-4.25,1.75) 40(-4.25,1.25) 41(-4.25,0.75) 42(-4.25,0.25) 43(-4.25,-0.25) 44(-4.25,-0.75) 45(-4.25,-1.25) 46(-4.25,-1.75) 47(-4.25,-2.25) 48(-4.25,-2.75)
MINI-USB-SMD_C105424
  rect 0.5x2.3 smd: 1(-1.6,2.75) 2(-0.8,2.75) 3(0,2.75) 4(0.8,2.75) 5(1.6,2.75)
  rect 2x2.5 smd: 6(4.35,2.75) 7(4.35,-2.75) 8(-4.35,2.75) 9(-4.35,-2.75)
OSC-TH_BD3.1-P0.8-D0.3
  round 1.2 hole 0.8: 1(0,0.8) 2(0,-0.8)
OSC-TH_L10.0-W4.5-P5.00
  round 1.6 hole 0.7: 1(0,2.45) 2(0,-2.45)
R0805
  rect 1.133x1.377 smd: 1(-1,0) 2(1,0)
SMA_L4.3-W2.6-LS5.0-RD
  rect 2.046x1.62 smd: 1(-2.404,-0.009) 2(2.404,0.009)
SOT-23-3_L2.9-W1.3-P1.90-LS2.4-BR
  rect 1.25x0.7 smd: 1(1,-0.95) 2(1,0.95) 3(-1,0)
SOT-223-3_L6.5-W3.4-P2.30-LS7.0-BR-1
  rect 2.5x1.1 smd: 1(2.97,-2.3) 2(2.97,0) 3(2.97,2.3)
  rect 2.34x3.6 smd: 2(-2.97,0)
SW-SMD_L6.0-W3.3-LS8.0
  rect 1.9x1.5 smd: 1(-4,0) 2(4,0)
固定孔封装
  round 0.584 hole 0.559: 1(-2.032,0) 1(-1.778,1.016) 1(-1.778,-1.016) 1(-1.016,1.778) 1(-1.016,-1.778) 1(0,-2.032) 1(1.016,1.778) 1(1.016,-1.778) 1(1.778,1.016) 1(1.778,-1.016) 1(2.032,0)
  round 0.584 hole 3.048x0.559: 1(0,2.032)
  round 5.08 hole 3.048: 1(0,0)
固定孔封装#2
  round 0.584 hole 0.559: 1(-2.032,0) 1(-1.778,1.016) 1(-1.778,-1.016) 1(-1.016,1.778) 1(-1.016,-1.778) 1(0,2.032) 1(0,-2.032) 1(1.016,1.778) 1(1.016,-1.778) 1(1.778,1.016) 1(1.778,-1.016) 1(2.032,0)
  round 5.08 hole 3.048: 1(0,0)

## Nets
As in the schematic, except:
GND: C1.1 C2.1 C3.1 C4.1 C5.1 C6.1 C7.1 C8.1 C9.1 C10.2 C11.2 C12.2 C13.2 C14.1 C15.1 C16.1 C17.1 C18.1 GND.1 GND.2 GND.3 H1.4 H2.5 H2.6 H3.3 H4.3 H9.1 H10.2 H10.7 H11.4 H12.5 H13.1 H14.1 H15.1 H18.1 H19.1 H20.1 H21.1 LED1.2 LED4.2 LED5.2 Q1.2 SW1.1 U1.1 U2.8 U2.23 U2.35 U2.47 USB1.5 USB1.6 USB1.7 USB1.8 USB1.9
VCC_3.3V: 3.3V.1 3.3V.2 3.3V.3 C8.2 C9.2 C10.1 C11.1 C12.1 C13.1 C14.2 C15.2 C16.2 C17.2 C18.2 H1.1 H2.1 H2.2 H11.1 R1.2 R3.2 U1.2 U2.1 U2.9 U2.24 U2.36 U2.48
VCC_5V: 5V.1 5V.2 5V.3 BUZZER1.1 C6.2 C7.2 D1.1 H9.2 H10.1 H12.1 H12.6 H13.2 H14.2 H15.2 U1.3 USB1.1

Pads without a net: H10 5 6; USB1 2 3 4

## Via types
v1: diameter 0.61, hole 0.305, Top Layer to Bottom Layer, 139 vias

## Routing (per net, layer and track width the routed paths; a pad name or vN(x,y) marks a point on that pad's centre or on a via; arc(x,y) is an arc through that point)
GND: length 290.4
  Top Layer w0.2: 53.85,33.56 55.75,33.56 55.75,32.13 57.27,32.13 57.28,32.14 ; 45.28,30.49 44.06,30.49 43.13,31.42 C10.2 ; 51.78,26.99 51.78,25.62 50.94,24.78 C12.2 ; U2.47 47.28,38.01 52.07,42.8 C18.1
  Top Layer w0.6: 52.07,48.57 52.07,50.93 38.61,50.93 38.35,51.18 H9.1 31.37,50.42 C4.1 34.2,37.36 C3.1 ; 52.07,48.57 C16.1 ; 52.07,48.57 65.04,48.57 H1.4 ; C2.1 40.06,36.33 C11.2 38.87,31.38 34.59,27.09 C5.1 ; H12.5 96.39,33.11 94.65,31.38 92.09,31.38 91.4,30.68 Q1.2 86,25.93 82.05,21.98 H13.1 ; C15.1 57.28,32.14 57.28,19.3 56.39,18.42 50.94,18.42 C13.2
  Top Layer w0.7: v1(64.26,32.26) v1(64.98,32.26) 65.02,32.3 v1(65.02,35.43) ; v1(67.89,39.04) H1.4 72.64,50.47 v1(72.64,54.1) 85.34,54.1 H10.7
  Bottom Layer w0.6: H3.3 94.62,20.7 ; 94.62,20.7 94.62,13.72 H4.3 ; 94.62,20.7 94.62,33.15 94.65,33.11 H12.5 ; H13.1 76.18,26.92 68.33,26.92 68.33,29.72 H2.6 ; H11.4 51.47,0.67 51.4,0.6 37.47,0.6 37.47,12.57 v1(36.45,13.59) v1(35.81,13.59)
  Bottom Layer w0.7: v1(16.51,15.49) 9.84,15.49 v1(7.93,17.41) ; v1(72.64,54.1) H10.2 ; v1(67.89,39.04) 67.89,38.3 v1(65.02,35.43)
  vias: v1(7.24,18.03) v1(7.24,17.41) v1(7.91,18.03) v1(16.51,14.73) v1(17.27,15.49) v1(17.27,14.76)
VCC_3.3V: length 175.7
  Top Layer w0.2: U2.36 57.21,34.07 C15.2 ; C12.1 52.94,24.91 52.28,25.57 52.28,26.99 ; C10.1 43.52,29.42 44.07,29.97 45.26,29.97 45.28,29.99 ; 45.28,33.99 v1(45.28,35.49) 46.78,35.49 46.78,38.27 50.07,41.56 v1(50.07,42.75) C18.2
  Top Layer w0.6: v1(61.47,34.15) C14.2 ; v1(36.96,35.31) v1(36.96,32.13) ; v1(54.48,41.78) 56.26,41.78 v1(58.17,39.88) ; C13.1 v1(52.94,19.56)
  Top Layer w0.7: R3.2 v1(42.42,9.25) 42.42,26.29 38.1,26.29 37.57,25.76 R1.2
  Top Layer w0.8: 3.3V.1 72.3,5.62 68.88,2.2 H11.1
  Bottom Layer w0.2: v1(51.71,7.49) 51.69,7.51 51.69,10.79 52.94,12.05 v1(52.94,19.56)
  Bottom Layer w0.6: v1(50.07,42.75) 53.51,42.75 v1(54.48,41.78) ; H1.1 75.51,37.54 73.46,35.49 73.46,34.15 ; H2.1 73.46,34.15 ; 73.46,34.15 v1(61.47,34.15) 61.47,36.58 v1(58.17,39.88) ; v1(42.8,28.07) v1(42.16,28.07) 36.96,28.07 v1(36.96,32.13) ; v1(45.28,35.49) 37.14,35.49 v1(36.96,35.31) ; v1(42.42,9.25) 42.42,8.64 43.56,7.49 v1(51.71,7.49) 53.79,7.49 H11.1
VCC_5V: length 189.2
  Top Layer w0.7: 13.97,23.89 13.97,10.45 C6.2 ; 13.97,23.89 20.19,30.11 20.19,46.86 32.51,59.18 41.02,59.18 41.02,57.53 H9.2 40.89,51.94 69.09,51.94 v1(69.98,52.83) ; 13.97,23.89 USB1.1 ; BUZZER1.1 82.42,43.07 v1(82.42,52.83)
  Top Layer w0.8: H13.2 84.59,22.74 92.42,30.58 H12.6 97.52,30.61 99.19,30.61 99.19,43.18 99.09,43.28 97.49,43.28 94.15,46.61 82.55,46.61 82.44,46.49 BUZZER1.1
  Bottom Layer w0.7: v1(82.42,52.83) v1(69.98,52.83) 69.98,57.35 H10.1
BEEP: length 56.3
  Top Layer w0.2: v1(71.37,42.16) 72.64,40.89 72.64,38.23 77.6,33.27 v1(78.23,33.27) ; R14.2 82.05,32.38 v1(81.15,33.27) ; v1(64.77,44.58) 66.8,42.55 v1(66.8,42.16) ; U2.39 51.28,34.72 51.05,34.49 v1(51.05,30.99)
  Bottom Layer w0.2: v1(78.23,33.27) v1(81.15,33.27) ; v1(66.8,42.16) v1(71.37,42.16) ; v1(64.77,44.58) 58.42,44.58 51.31,37.47 51.31,34.67 51.05,34.42 v1(51.05,30.99)
BOOT0: length 23.3
  Top Layer w0.2: 48.78,35.49 48.78,36.83 68.92,36.83 R4.1
BOOT1: length 41.8
  Top Layer w0.2: R5.2 67.22,25.4 60.32,25.4 60.32,17.4 46.86,17.4 46.86,22.72 50.28,26.14 50.28,26.99
INT: length 51.6
  Top Layer w0.2: U2.38 v1(51.78,34.16)
  Bottom Layer w0.2: v1(51.78,34.16) 51.78,36.92 58.8,43.94 70.36,43.94 71.75,45.34 71.75,47.12 76.33,51.69 85.22,51.69 87.88,54.36 H10.8
LED0: length 52.4
  Top Layer w0.2: v1(49.02,28.45) 49.28,28.19 49.28,26.99 ; v1(43.31,25.53) 44.32,26.54 v1(45.97,26.54)
  Top Layer w0.4: R8.1 v1(15.75,40.21)
  Bottom Layer w0.2: v1(43.31,25.53) 18.74,25.53 18.16,26.11 18.16,37.8 v1(15.75,40.21) ; v1(49.02,28.45) 49.02,26.54 v1(45.97,26.54)
LED1: length 50.8
  Top Layer w0.2: v1(45.97,25.65) 45.09,24.77 v1(43.31,24.77) ; v1(50.04,28.45) 49.78,28.19 49.78,26.99
  Top Layer w0.4: R9.1 v1(15.88,34.9)
  Bottom Layer w0.2: v1(43.31,24.77) 16.89,24.77 15.88,25.78 v1(15.88,34.9) ; v1(45.97,25.65) 50.04,25.65 v1(50.04,28.45)
OSC32_IN: length 19.4
  Top Layer w0.2: Y1.2 39.04,44.45 C2.2 43.05,39.36 43.05,34.16 44.22,32.99 45.28,32.99
OSC32_OUT: length 18.1
  Top Layer w0.2: 45.28,32.49 44.3,32.49 42.75,34.04 42.75,38.28 42.67,38.35 36.63,38.35 C3.2 Y1.1
OSC_IN: length 24.4
  Top Layer w0.2: v1(34.75,34.29) R2.2 33.54,31.73 32.75,32.53 C4.2 29.07,32.53 27.67,33.93 Y2.1 ; v1(43.81,32.13) 43.95,31.99 45.28,31.99
  Bottom Layer w0.2: v1(34.75,34.29) 41.66,34.29 v1(43.81,32.13)
OSC_OUT: length 21.8
  Top Layer w0.2: v1(38.35,32.26) 35.83,29.73 R2.1 33.54,29.73 32.9,29.09 C5.2 31.31,29.03 Y2.2 ; v1(44.07,31.37) 44.19,31.49 45.28,31.49
  Bottom Layer w0.2: v1(38.35,32.26) 39.62,32.26 40.51,31.37 v1(44.07,31.37)
PA0: length 28.5
  Top Layer w0.2: 45.26,29.49 45.29,29.46 v1(48.51,29.46)
  Bottom Layer w0.2: 50.42,9.53 45.34,14.61 45.34,29.46 v1(48.51,29.46)
PA8: length 58.6
  Top Layer w0.2: v1(69.22,21.08) v1(60.96,21.08) ; H15.3 92.07,15.37 92.07,12.32 v1(87.63,12.32) ; U2.29 53.74,30.61 v1(52.2,30.61)
  Bottom Layer w0.2: v1(69.22,21.08) 69.98,21.08 78.74,12.32 v1(87.63,12.32) ; v1(60.96,21.08) 54.86,27.18 53.47,27.18 51.82,28.83 51.82,30.23 v1(52.2,30.61)
PA11: length 32
  Top Layer w0.2: v1(55.12,31.88) 54.93,32.07 U2.32
  Bottom Layer w0.2: v1(55.12,31.88) 57.05,31.88 59.06,29.87 59.06,28.19 67.69,19.56 67.69,14.1 H22.7
PA12: length 42.6
  Top Layer w0.2: v1(62.36,33.27) 62.36,34.42 60.83,35.94 v1(54.99,35.94) ; v1(52.2,32.57) U2.33
  Bottom Layer w0.2: v1(52.2,32.57) 54.99,35.36 v1(54.99,35.94) ; H22.8 68.33,12.19 68.33,19.69 62.36,25.65 v1(62.36,33.27)
PB4: length 58.9
  Top Layer w0.2: v1(63.25,33.27) 63.25,33.69 63.12,33.82 63.12,35.31 v1(62.61,35.81) ; U2.40 50.67,35.46 50.67,32.26 v1(50.04,31.62) ; v1(59.56,41.02) 57.91,42.67 54.48,42.67 v1(52.71,40.89)
  Bottom Layer w0.2: v1(52.71,40.89) 52.71,39.62 50.67,37.59 50.67,32.26 v1(50.04,31.62) ; H22.9 69.34,10.67 69.34,19.3 63.25,25.4 v1(63.25,33.27) ; v1(59.56,41.02) 62.61,37.97 v1(62.61,35.81)
PB5: length 62.3
  Top Layer w0.2: v1(61.47,41.02) 59.06,43.43 53.97,43.43 v1(51.44,40.89) ; v1(64.1,33.27) 64.1,35.47 v1(63.75,35.81) ; v1(49.78,32.51) 50.28,33.01 U2.41
  Bottom Layer w0.2: v1(64.1,33.27) 65.91,33.27 66.04,33.15 66.04,30.23 64.26,28.45 64.26,25.27 68.73,20.8 68.73,20.52 70.74,18.51 H22.10 ; v1(51.44,40.89) 51.44,38.99 50.29,37.85 50.29,33.02 v1(49.78,32.51) ; v1(63.75,35.81) 63.75,38.73 v1(61.47,41.02)
PB6: length 92.4
  Top Layer w0.2: v1(79.12,10.79) 79.12,40.13 78.99,40.26 v1(73.41,40.26) ; v1(49.53,33.4) 49.78,33.65 U2.42 ; H14.3 92.2,18.2 92.46,17.94 92.46,11.46 v1(88.3,11.46) ; v1(50.16,38.73) 63.63,38.73 v1(65.15,40.26)
  Bottom Layer w0.2: v1(79.12,10.79) 79.79,11.46 v1(88.3,11.46) ; v1(49.53,33.4) 49.73,33.6 49.73,38.3 v1(50.16,38.73) ; v1(65.15,40.26) v1(73.41,40.26)
PB7: length 98.2
  Top Layer w0.2: v1(48.9,34.04) 49.28,34.42 U2.43 ; v1(89.15,10.79) 93.47,10.79 93.47,20.7 93.12,21.05 H13.3 ; v1(81.66,10.79) 79.76,12.7 79.76,41.53 v1(73.53,41.53) ; v1(50.16,39.62) 50.57,39.22 62.71,39.22 v1(65.02,41.53)
  Bottom Layer w0.2: v1(81.66,10.79) v1(89.15,10.79) ; v1(65.02,41.53) v1(73.53,41.53) ; v1(48.9,34.04) 49.28,34.42 49.28,38.73 v1(50.16,39.62)
PB12: length 29.1
  Top Layer w0.2: 53.78,28.49 v1(53.78,27.87)
  Bottom Layer w0.2: H22.3 53.94,9.53 63.8,19.39 55.31,27.87 v1(53.78,27.87)
PB13: length 29.8
  Top Layer w0.2: U2.26 v1(54.99,29.07)
  Bottom Layer w0.2: v1(54.99,29.07) 65.51,18.55 56.48,9.53 H22.4
PB14: length 32.6
  Top Layer w0.2: U2.27 53.76,29.59 v1(52.45,29.59)
  Bottom Layer w0.2: v1(52.45,29.59) 52.58,29.72 55.25,29.72 65.91,19.05 65.91,16.42 59.02,9.53 H22.5
PB15: length 30.4
  Top Layer w0.2: U2.28 53.81,30.1 v1(56.26,30.1)
  Bottom Layer w0.2: H22.6 61.34,9.53 66.68,14.86 66.68,19.69 v1(56.26,30.1)
PC13: length 29.9
  Top Layer w0.2: 45.28,33.49 v1(46.99,33.49)
  Bottom Layer w0.2: H22.1 44.7,12.7 44.7,29.72 45.21,30.23 47.62,30.23 47.62,32.86 v1(46.99,33.49)
RESET: length 20.1
  Top Layer w0.2: U2.7 v1(46.86,31.07)
  Bottom Layer w0.2: v1(39.37,19.3) v1(40.08,19.3) 42.04,19.3 43.86,21.13 43.86,27.18 43.69,27.18 43.69,28.19 43.31,28.58 43.31,30.1 43.87,30.66 46.46,30.66 v1(46.86,31.07)
RX1: length 64.8
  Top Layer w0.2: v1(58.42,28.83) 61.09,28.83 62.74,27.18 v1(64.9,27.18) ; U2.31 v1(52.2,31.57) ; v1(92.07,23.24) H3.2
  Bottom Layer w0.2: v1(52.2,31.57) 53.39,31.57 54.56,30.41 55.55,30.41 55.88,30.73 56.51,30.73 v1(58.42,28.83) ; v1(92.07,23.24) 91.44,22.61 91.44,12.95 79.12,12.95 v1(64.9,27.18)
RX2: length 132.7
  Top Layer w0.2: v1(23.24,26.54) 23.24,22.48 25.27,22.48 v1(25.27,15.75) ; v1(52.07,5.59) 52.2,5.46 v1(59.69,5.46) ; H4.2 99.06,11.81 99.06,1.65 98.3,0.89 91.69,0.89 v1(91.44,0.63) ; v1(39.88,5.59) v1(30.73,5.59) ; 46.79,27 46.62,27.18 45.21,27.18 44.96,26.92 43.69,26.92 v1(43.31,26.54)
  Bottom Layer w0.2: v1(30.73,5.59) 30.73,10.29 v1(25.27,15.75) ; v1(59.69,5.46) 70.23,5.46 75.06,0.63 v1(91.44,0.63) ; v1(39.88,5.59) 40.39,6.1 48.13,6.1 48.64,5.59 v1(52.07,5.59) ; v1(43.31,26.54) v1(23.24,26.54)
RX3: length 60.7
  Top Layer w0.2: v1(61.85,19.3) 70.49,19.3 v1(78.23,27.05) ; H12.4 94.09,32.26 v1(89.66,32.26) ; 51.28,26.99 51.31,27.02 v1(51.31,28.45) ; v1(58.93,19.3) 58.93,21.21 v1(58.8,21.34)
  Bottom Layer w0.2: v1(51.31,28.45) 51.31,26.03 56.01,21.34 v1(58.8,21.34) ; v1(78.23,27.05) 83.44,32.26 v1(89.66,32.26) ; v1(61.85,19.3) v1(58.93,19.3)
SCL: length 58.4
  Top Layer w0.2: H9.3 43.43,55.5 73.21,55.5 H10.3 ; 48.28,35.49 48.28,36.56 v1(48.13,36.7)
  Bottom Layer w0.2: v1(48.13,36.7) 48.13,52.7 H9.3
SDA: length 65.9
  Top Layer w0.2: H9.4 53.72,57.4 55.37,59.06 76.14,59.06 H10.4 ; 47.78,35.49 v1(47.78,34.16)
  Bottom Layer w0.2: H9.4 44.58,58.8 42.16,58.8 42.16,56.13 47.58,50.72 47.58,34.16 v1(47.78,34.16)
SPI1_CS: length 40.5
  Top Layer w0.2: 47.28,26.99 47.28,26.07 44.45,23.24 44.45,0.51 54.85,0.51 H11.2
SPI1_MISO: length 32.2
  Top Layer w0.2: v1(45.76,5.46) 45.76,23.03 48.28,25.55 48.28,26.99 ; H11.3 50.75,5.46 v1(47.24,5.46)
  Bottom Layer w0.2: v1(47.24,5.46) v1(45.76,5.46)
SPI1_MOSI: length 25.8
  Top Layer w0.2: 48.78,26.99 48.77,26.98 48.77,25.27 46.39,22.89 H11.6
SPI1_SCK: length 31.4
  Top Layer w0.2: H11.5 47.74,1.02 45.09,1.02 45.09,23.24 47.78,25.94 47.78,26.99
SWDCLK: length 28.3
  Top Layer w0.2: H1.3 70.43,37.47 v1(54.61,37.47) ; U2.37 v1(53.09,35.57)
  Bottom Layer w0.2: v1(53.09,35.57) 53.09,37.47 v1(54.61,37.47)
SWDIO: length 27.9
  Top Layer w0.2: v1(54.99,32.89) 54.81,33.07 U2.34
  Bottom Layer w0.2: H1.2 72.56,45.72 69.64,42.8 59.18,42.8 55.63,39.24 55.63,33.53 v1(54.99,32.89)
TX1: length 62.3
  Top Layer w0.2: H3.1 92.2,25.78 v1(91.82,25.4) ; U2.30 v1(54.99,31.07) ; v1(58.29,29.84) 61.09,29.84 62.99,27.94 v1(65.91,27.94)
  Bottom Layer w0.2: v1(54.99,31.07) 57.07,31.07 v1(58.29,29.84) ; v1(91.82,25.4) 90.3,23.88 90.3,13.46 80.39,13.46 v1(65.91,27.94)
TX2: length 126.3
  Top Layer w0.2: v1(51.94,6.6) 52.2,6.35 v1(59.44,6.35) ; v1(42.29,27.18) 42.49,27.38 44.17,27.38 45.28,28.49 ; v1(39.75,6.73) v1(32,6.73) ; v1(91.31,1.52) 97.92,1.52 98.17,1.78 98.17,6.48 95.12,9.53 95.12,13.46 H4.1 ; v1(27.18,16) v1(27.18,27.18)
  Bottom Layer w0.2: v1(27.18,16) 32,11.18 v1(32,6.73) ; v1(91.31,1.52) 90.81,1.02 75.18,1.02 69.85,6.35 v1(59.44,6.35) ; v1(42.29,27.18) v1(27.18,27.18) ; v1(39.75,6.73) 39.88,6.6 v1(51.94,6.6)
TX3: length 58
  Top Layer w0.2: v1(61.85,20.32) 69.72,20.32 v1(77.09,27.69) ; 50.78,26.99 50.78,25.51 v1(50.67,25.4) ; H12.3 92.82,33.53 v1(89.66,33.53)
  Bottom Layer w0.2: v1(61.85,20.32) 55.75,20.32 v1(50.67,25.4) ; v1(77.09,27.69) 82.93,33.53 v1(89.66,33.53)
WIFI_RST: length 140.7
  Top Layer w0.2: v1(44.07,29.08) 44.16,28.99 45.28,28.99 ; v1(75.95,49.78) v1(73.41,49.78) ; v1(49.53,50.17) 46.99,50.17 v1(46.61,49.78) ; v1(20.95,24) 20.95,45.59 v1(25.15,49.78)
  Bottom Layer w0.2: v1(73.41,49.78) v1(70.1,49.78) 69.72,50.17 v1(49.53,50.17) ; v1(25.15,49.78) v1(46.61,49.78) ; H12.2 88.44,49.78 v1(75.95,49.78) ; v1(20.95,24) 26.54,18.42 42.67,18.42 v1(43.69,19.43) 43.81,19.43 44.32,19.94 44.32,28.83 v1(44.07,29.08)
$1N5135: length 23.6
  Top Layer w0.6: R3.1 v1(40.13,13.33) ; LED1.1 v1(22.73,17.27)
  Bottom Layer w0.7: v1(40.13,13.33) 36.2,17.27 v1(22.73,17.27)
$1N5723: length 3.6
  Top Layer w0.8: LED4.1 11.41,40.22 R8.2
$1N5726: length 3.6
  Top Layer w0.8: R9.2 11.47,34.89 LED5.1

## Copper pours and planes (outline as drawn; the poured copper is in the pictures)
GND on Top Layer: 39.14,32.26 42.94,32.26 42.94,30.73 39.14,30.73
GND on Top Layer: 18.67,18.54 15.49,18.54 15.49,11.82 27.17,11.82 27.18,11.81 27.18,13.33 27.28,13.43 33.44,13.43 33.66,13.22 33.66,10.54 38.35,10.54 38.48,10.67 38.48,13.97 38.35,14.1 34.93,14.1 34.8,14.22 34.8,15.49 34.8,15.62 32.77,15.62 32.77,17.65 32.76,17.78 30.1,17.78 30.1,14.99 29.97,14.86 18.66,14.86 18.67,14.99
GND on Top Layer: 0,58 0.02,58.28 0.08,58.56 0.18,58.83 0.32,59.08 0.49,59.31 0.69,59.51 0.92,59.68 1.17,59.82 1.44,59.92 1.72,59.98 2,60 98,60 98.28,59.98 98.56,59.92 98.83,59.82 99.08,59.68 99.31,59.51 99.51,59.31 99.68,59.08 99.82,58.83 99.92,58.56 99.98,58.28 100,58 100,2 99.98,1.72 99.92,1.44 99.82,1.17 99.68,0.92 99.51,0.69 99.31,0.49 99.08,0.32 98.83,0.18 98.56,0.08 98.28,0.02 98,0 2,0 1.72,0.02 1.44,0.08 1.17,0.18 0.92,0.32 0.69,0.49 0.49,0.69 0.32,0.92 0.18,1.17 0.08,1.44 0.02,1.72 0,2
GND on Top Layer: 80.76,3.61 88.8,3.61 88.8,1.07 80.76,1.07
GND on Top Layer: 49.74,24.34 51.56,24.34 51.56,20.07 49.74,20.07
GND on Top Layer: 80.57,22.32 83.2,22.32 83.2,14.1 80.57,14.1
GND on Top Layer: 30.23,27.81 32.64,27.81 32.64,21.72 38.17,21.72 38.17,19.51 32.56,19.51 32.64,15.75 30.35,15.75 30.23,15.88
GND on Top Layer: 3.05,28.32 12.45,28.32 12.57,28.19 12.57,25.02 12.45,24.89 12.38,24.96 8.53,24.96 8.53,21.19 8.89,20.83 11.68,20.83 11.81,20.95 11.81,17.02 11.94,16.89 3.05,16.89
GND on Top Layer: 38.99,32.64 43.18,32.64 43.18,30.73 38.99,30.73
GND on Top Layer: 67.11,33.59 69.49,33.59 69.49,28.51 67.11,28.51
GND on Top Layer: 35.43,37.97 40.13,37.97 40.13,35.94 35.43,35.94
GND on Top Layer: 58.7,32.75 66.91,32.75 67.06,32.89 67.06,33.53 67.18,33.66 69.34,33.66 69.47,33.53 69.47,28.58 69.34,28.45 63.25,29.06 62.87,30.73 58.67,30.73 58.55,30.86 58.7,31.01
GND on Top Layer: 56.09,32.75 60.71,32.75 60.71,30.99 56.09,30.99
GND on Top Layer: 3.68,42.04 6.68,42.04 6.68,28.14 6.48,27.94 3.68,27.94
GND on Top Layer: 51.18,49.66 53.09,49.66 53.09,43.31 51.18,43.31
GND on Bottom Layer: 0,58 0.02,58.28 0.08,58.56 0.18,58.83 0.32,59.08 0.49,59.31 0.69,59.51 0.92,59.68 1.17,59.82 1.44,59.92 1.72,59.98 2,60 98,60 98.28,59.98 98.56,59.92 98.83,59.82 99.08,59.68 99.31,59.51 99.51,59.31 99.68,59.08 99.82,58.83 99.92,58.56 99.98,58.28 100,58 100,2 99.98,1.72 99.92,1.44 99.82,1.17 99.68,0.92 99.51,0.69 99.31,0.49 99.08,0.32 98.83,0.18 98.56,0.08 98.28,0.02 98,0 2,0 1.72,0.02 1.44,0.08 1.17,0.18 0.92,0.32 0.69,0.49 0.49,0.69 0.32,0.92 0.18,1.17 0.08,1.44 0.02,1.72 0,2
GND on Bottom Layer: 6.74,18.48 8.38,18.48 8.38,17.02 6.74,17.02
GND on Bottom Layer: 15.75,16 17.91,16 17.91,14.22 15.75,14.22
VCC_3.3V on Top Layer: 49.02,49.53 50.8,49.53 50.8,43.3 49.02,43.3
VCC_3.3V on Top Layer: 22.61,11.3 28.83,11.3 28.83,12.62 32.38,12.62 32.38,10.15 41.16,10.15 41.66,9.65 41.66,7.87 41.4,7.62 28.83,7.62 28.45,8 28.45,9.4 28.32,9.53 22.61,9.53
VCC_3.3V on Top Layer: 56.13,35.31 60.67,35.31 60.67,33.55 56.13,33.55
VCC_3.3V on Top Layer: 41.13,30.38 41.13,27.69 41.13,27.69 38.23,27.69 38.23,22.23 38.1,22.22 36.58,22.22 36.58,28.07 38.89,30.38
VCC_3.3V on Top Layer: 80.76,6.89 88.59,6.89 88.59,4.35 80.76,4.35
VCC_3.3V on Top Layer: 38.96,30.38 43.31,30.38 43.31,27.81 38.96,27.81
VCC_3.3V on Top Layer: 52.34,24.38 54.08,24.38 54.08,20.33 52.34,20.33
VCC_3.3V on Top Layer: 72.19,33.59 74.73,33.59 74.73,28.51 72.19,28.51
VCC_5V on Top Layer: 80.76,10.18 88.8,10.18 88.8,7.64 80.76,7.64
VCC_5V on Top Layer: 83.48,22.32 85.83,22.32 85.83,14.1 83.48,14.1
VCC_5V on Top Layer: 15.62,11.3 21.59,11.3 21.72,11.18 21.72,9.4 22.35,8.76 26.42,8.76 26.92,8.25 26.92,5.46 26.54,5.08 15.88,5.08 15.62,5.33
VCC_5V on Top Layer: 83.49,16.64 86.08,16.64 86.08,7.64 83.49,7.64
VCC_5V on Top Layer: 81.28,44.07 83.69,44.07 83.69,34.8 81.28,34.8
RESET on Top Layer: 38.86,24.64 40.77,24.64 40.77,15.24 38.23,15.24 38.1,15.37 38.1,17.65 38.86,18.41
$1N2099 on Top Layer: 70.1,35.94 71.75,35.94 71.75,31.62 70.1,31.62
$1N2100 on Top Layer: 70.1,30.48 71.88,30.48 71.88,26.03 70.1,26.03
$1N9189 on Top Layer: 84.71,31.37 84.71,29.23 85.2,29.23 85.34,29.08 85.34,26.92 84.96,26.54 83.31,26.54 83.31,31.37
$1N9400 on Top Layer: 85.72,44.07 88.77,44.07 88.77,36.83 85.72,36.83
$1N9400 on Top Layer: 88.77,37.08 88.77,34.29 85.6,34.29 85.6,32 85.47,31.88 84.37,31.88 84.37,34.46 85.69,35.78 85.69,37.08

## Text on the board
Top Silkscreen Layer: MOSI | C13 | SCK | A0 | GND | B12 | MISO | B13 | CS | B14 | B15 | 3.3V | A11 | A12 | B4 | CLK | B5 | DIO | 5V | SCL | SDA | BOOT0 | BOOT1 | AD0 | INT | PB7 | PB6 | PA8 | RST | TX3 | RX3 | TX2 | RX2 | TX1 | RX1 | 最小系统板V1.0
